# Altium project BauhallenUhr.PrjPcb
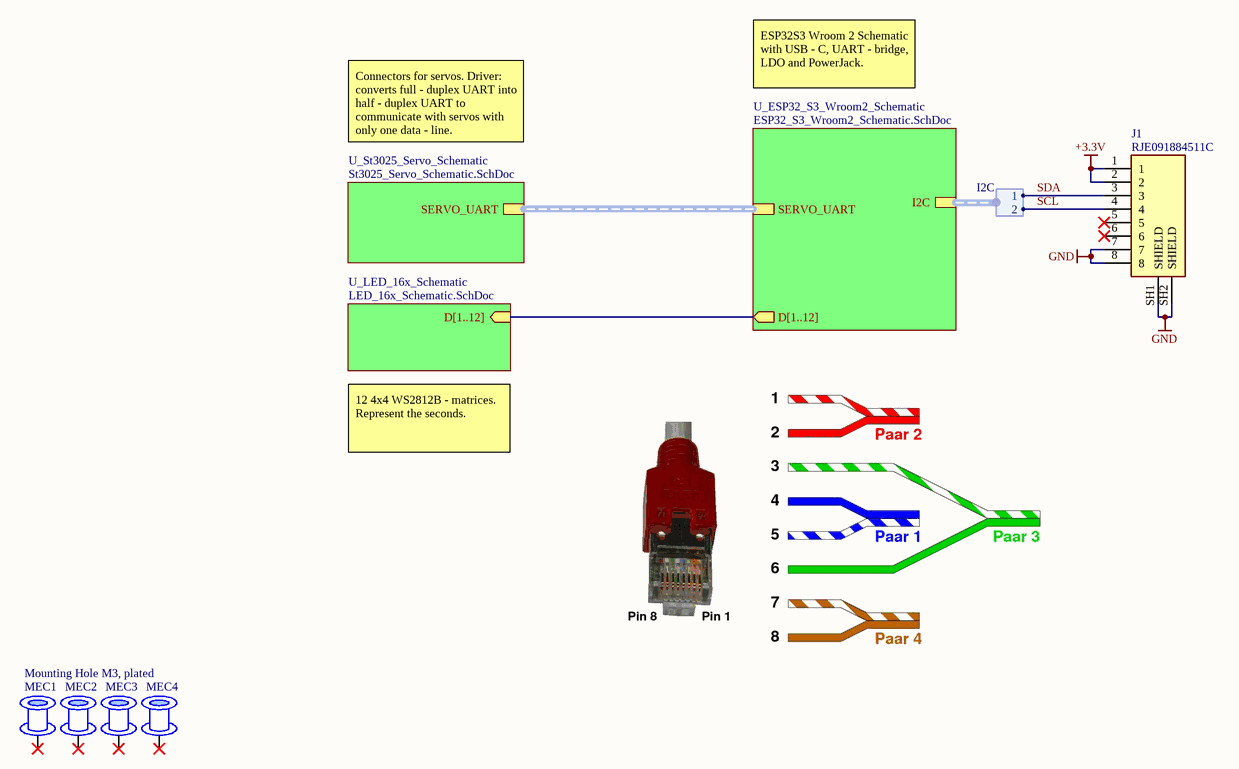
[diagram p0: Blackbox_BauhallenUhr_Schematic.SchDoc]
Author: Manuel Hueppi; Departement: DBAUG; Institut: IBK; Revision: V0.1
4 sheets, 107 parts. Net scope: hierarchical (ports join the sheet entries above them; power ports are global).
Board file: BauhallenUhr.PcbDoc
Sheets:
  Blackbox_BauhallenUhr_Schematic.SchDoc
    U_St3025_Servo_Schematic = St3025_Servo_Schematic.SchDoc
    U_ESP32_S3_Wroom2_Schematic = ESP32_S3_Wroom2_Schematic.SchDoc
    U_LED_16x_Schematic = LED_16x_Schematic.SchDoc

## Sheet Blackbox_BauhallenUhr_Schematic.SchDoc
size A4; DocumentNumber: 1; SheetNumber: 1; SheetTotal: 6

### Parts
J1  RJE091884511C  [RJ45]
MEC1  Mounting Hole M3, plated  [Mounting Hole M3, plated]
MEC2  Mounting Hole M3, plated  [Mounting Hole M3, plated]  (value not drawn)
MEC3  Mounting Hole M3, plated  [Mounting Hole M3, plated]  (value not drawn)
MEC4  Mounting Hole M3, plated  [Mounting Hole M3, plated]  (value not drawn)

### Sub-sheets
U_ESP32_S3_Wroom2_Schematic = ESP32_S3_Wroom2_Schematic.SchDoc: D[1..12] (out), I2C (harness I2C), SERVO_UART (harness SERVO_UART)
U_LED_16x_Schematic = LED_16x_Schematic.SchDoc: D[1..12] (in)
U_St3025_Servo_Schematic = St3025_Servo_Schematic.SchDoc: SERVO_UART (harness SERVO_UART)

### Harnesses
I2C: 1, 2

### Nets
+3.3V: J1.1 J1.2
GND: J1.7 J1.8 J1.SH1(SHIELD) J1.SH2(SHIELD)
SCL: J1.4 ; sheet U_ESP32_S3_Wroom2_Schematic/I2C.2
SDA: J1.3 ; sheet U_ESP32_S3_Wroom2_Schematic/I2C.1

Not connected (* = marked no-connect by the designer): J1 5* 6*; MEC1 1*; MEC2 1*; MEC3 1*; MEC4 1*

### Buses and harness runs
bus sheet U_ESP32_S3_Wroom2_Schematic/D[1..12] = sheet U_LED_16x_Schematic/D[1..12]
harness sheet U_ESP32_S3_Wroom2_Schematic/SERVO_UART = sheet U_St3025_Servo_Schematic/SERVO_UART

### Notes on the sheet
- ESP32S3 Wroom 2 Schematic with USB - C, UART - bridge, LDO and PowerJack.
- Connectors for servos. Driver: converts full - duplex UART into half - duplex UART to communicate with servos with only one data - line.
- 12 4x4 WS2812B - matrices. Represent the seconds.
- Date:
- Title of drawing:
- Time:
- Drawn by:
- Project:
- Revision:
- Institut:
- Departement:
- Page:
- from:
- File:

### Library data of the parts
J1 = RJ45: Jack Modular Connector 8p8c (RJ45, Ethernet) 90Â° Angle (Right) Shielded Cat3.; MF: Amphenol ICC (Commercial Products); SnapEDA_Link: https://www.snapeda.com/parts/RJE091884511C/Amphenol/view-part/?ref=snap; Package: None; System: Connector; MP: RJE091884511C; Check_prices: https://www.snapeda.com/parts/RJE091884511C/Amphenol/view-part/?ref=eda; Parameter 1: *
MEC1-MEC4 = Mounting Hole M3, plated: Mounting Hole for M3 Screw, plated to connect signal

## Sheet St3025_Servo_Schematic.SchDoc
size A4; DocumentNumber: 3; SheetNumber: 3; SheetTotal: 6
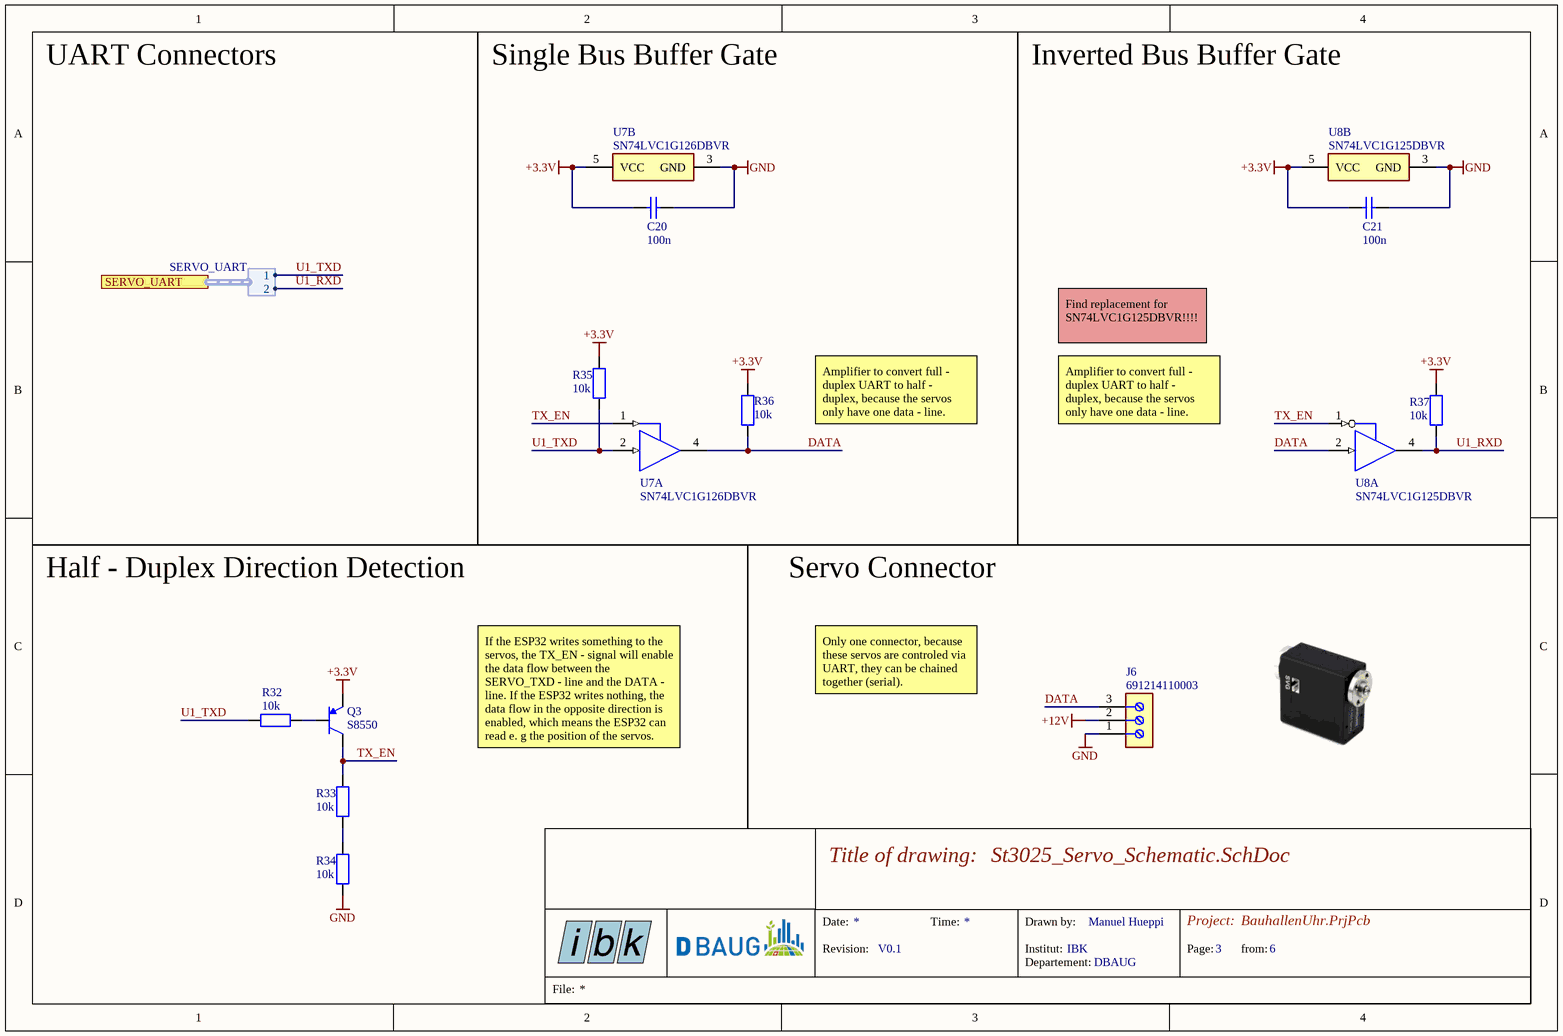
[diagram p1: St3025_Servo_Schematic.SchDoc]

### Parts
C20  100n  [0603_CAPACITOR]
C21  100n  [0603_CAPACITOR]
J6  691214110003  [Screw_Connector]
Q3  S8550  [PNP_Bipolar_Transistor]
R32  10k  [0603_Resistor]
R33  10k  [0603_Resistor]
R34  10k  [0603_Resistor]
R35  10k  [0603_Resistor]
R36  10k  [0603_Resistor]
R37  10k  [0603_Resistor]
U7  SN74LVC1G126DBVR  [DBV0005A_L_Single_Bus_Buffer_Gate]  (parts A,B of 2)
U8  SN74LVC1G125DBVR  [DBV0005A_L_Single_Bus_Buffer_Gate]  (parts A,B of 2)

### Ports
SERVO_UART (harness SERVO_UART)

### Harnesses
SERVO_UART: 1, 2

### Nets
+3.3V: C20.2 C21.2 Q3.2(E) R35.2 R36.2 R37.2 U7.5(VCC) U8.5(VCC)
+12V: J6.2
GND: C20.1 C21.1 J6.1 R34.1 U7.3(GND) U8.3(GND)
DATA: J6.3 R36.1 U7.4(Y) U8.2(A)
TX_EN: Q3.3(C) R33.2 U7.1(OE) U8.1(OE)
U1_RXD: R37.1 U8.4(Y) ; port SERVO_UART.2
U1_TXD: R32.2 R35.1 U7.2(A) ; port SERVO_UART.1
NetQ3_1: Q3.1(B) R32.1
NetR33_1: R33.1 R34.2

### Notes on the sheet
- UART Connectors
- Single Bus Buffer Gate
- Inverted Bus Buffer Gate
- Find replacement for SN74LVC1G125DBVR!!!!
- Amplifier to convert full - duplex UART to half - duplex, because the servos only have one data - line.
- Half - Duplex Direction Detection
- Servo Connector
- Only one connector, because these servos are controled via UART, they can be chained together (serial).
- If the ESP32 writes something to the servos, the TX_EN - signal will enable the data flow between the SERVO_TXD - line and the DATA - line. If the ESP32 writes nothing, the data flow in the opposite direction is enabled, which means the ESP32 can read e. g the position of the servos.
- Date:
- Title of drawing:
- Time:
- Drawn by:
- Project:
- Revision:
- Institut:
- Departement:
- Page:
- from:
- File:

### Library data of the parts
C20 C21 = Capacitor: 0603
J6 = Screw_Connector: 691214110003 Wurth Elektronik
Q3 = PNP_Bipolar_Transistor: Bipolar (BJT) Transistor PNP 25 V 500 mA 150MHz 300 mW Surface Mount SOT-23.
R32-R37 = Resistor: 0603
U7 = Single_Bus_Buffer_Gate: Single Bus Buffer Gate With 3-State Outputs, DBV0005A, LARGE T&R.; ComponentLink1Description: Supplier; ComponentLink1URL: https://www.digikey.com/en/products/detail/texas-instruments/SN74LVC1G126DBVR/385722
U8 = Single_Bus_Buffer_Gate_Inverted: Single Bus Buffer Gate With 3-State Outputs, DBV0005A, LARGE T&R.; ComponentLink1Description: Supplier; ComponentLink1URL: *

## Sheet ESP32_S3_Wroom2_Schematic.SchDoc
size A3; DocumentNumber: 2; SheetNumber: 2; SheetTotal: 6
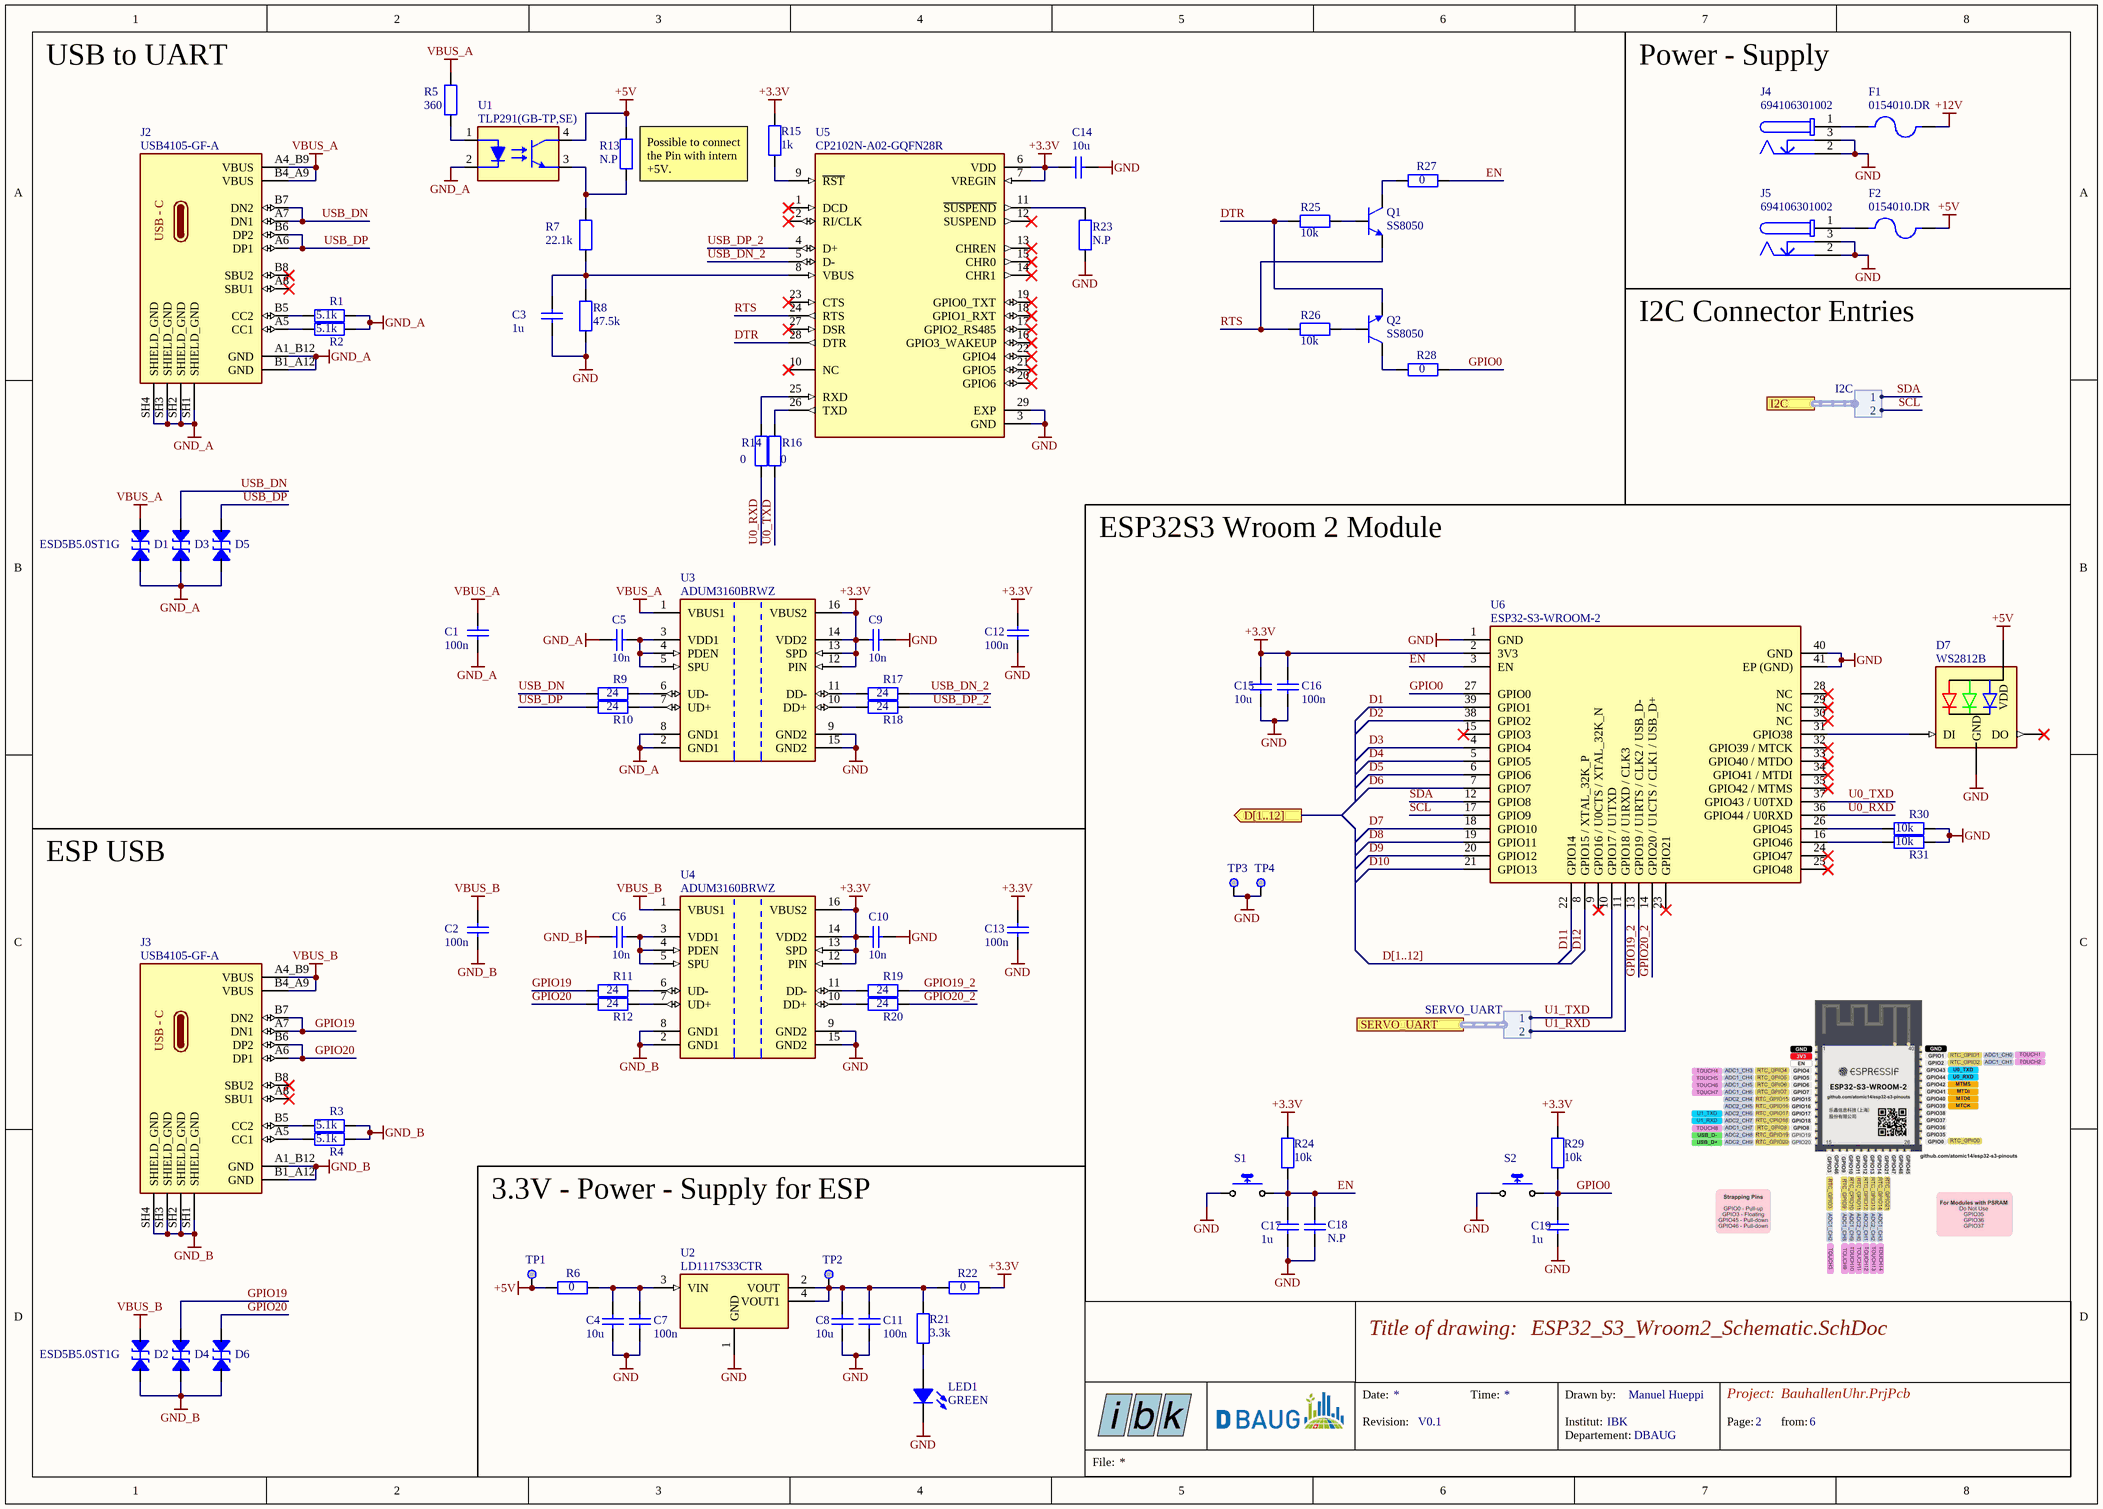
[diagram p2: ESP32_S3_Wroom2_Schematic.SchDoc]

### Parts
C1  100n  [0603_CAPACITOR]
C2  100n  [0603_CAPACITOR]
C3  1u  [0603_CAPACITOR]
C4  10u  [0603_CAPACITOR]
C5  10n  [0603_CAPACITOR]
C6  10n  [0603_CAPACITOR]
C7  100n  [0603_CAPACITOR]
C8  10u  [0603_CAPACITOR]
C9  10n  [0603_CAPACITOR]
C10  10n  [0603_CAPACITOR]
C11  100n  [0603_CAPACITOR]
C12  100n  [0603_CAPACITOR]
C13  100n  [0603_CAPACITOR]
C14  10u  [0603_CAPACITOR]
C15  10u  [0603_CAPACITOR]
C16  100n  [0603_CAPACITOR]
C17  1u  [0603_CAPACITOR]
C18  N.P  [0603_CAPACITOR]
C19  1u  [0603_CAPACITOR]
D1  ESD5B5.0ST1G  [ESD_Protecction_Diode]
D2  ESD5B5.0ST1G  [ESD_Protecction_Diode]
D3  ESD5B5.0ST1G  [ESD_Protecction_Diode]  (value not drawn)
D4  ESD5B5.0ST1G  [ESD_Protecction_Diode]  (value not drawn)
D5  ESD5B5.0ST1G  [ESD_Protecction_Diode]  (value not drawn)
D6  ESD5B5.0ST1G  [ESD_Protecction_Diode]  (value not drawn)
D7  WS2812B  [WS2812B]
F1  0154010.DR  [Fuse]
F2  0154010.DR  [Fuse]
J2  USB4105-GF-A  [USB4105-GF-A]
J3  USB4105-GF-A  [USB4105-GF-A]
J4  694106301002  [DC_PowerJack_THT]
J5  694106301002  [DC_PowerJack_THT]
LED1  GREEN  [LED_0603, GREEN]
Q1  SS8050  [NPN_Bipolar_Transistor]
Q2  SS8050  [NPN_Bipolar_Transistor]
R1  5.1k  [0603_Resistor]
R2  5.1k  [0603_Resistor]
R3  5.1k  [0603_Resistor]
R4  5.1k  [0603_Resistor]
R5  360  [0603_Resistor]
R6  0  [0603_Resistor]
R7  22.1k  [0603_Resistor]
R8  47.5k  [0603_Resistor]
R9  24  [0603_Resistor]
R10  24  [0603_Resistor]
R11  24  [0603_Resistor]
R12  24  [0603_Resistor]
R13  N.P  [0603_Resistor]
R14  0  [0603_Resistor]
R15  1k  [0603_Resistor]
R16  0  [0603_Resistor]
R17  24  [0603_Resistor]
R18  24  [0603_Resistor]
R19  24  [0603_Resistor]
R20  24  [0603_Resistor]
R21  3.3k  [0603_Resistor]
R22  0  [0603_Resistor]
R23  N.P  [0603_Resistor]
R24  10k  [0603_Resistor]
R25  10k  [0603_Resistor]
R26  10k  [0603_Resistor]
R27  0  [0603_Resistor]
R28  0  [0603_Resistor]
R29  10k  [0603_Resistor]
R30  10k  [0603_Resistor]
R31  10k  [0603_Resistor]
S1  ?  [PTS636SK25SMTR]  (value not drawn)
S2  ?  [PTS636SK25SMTR]  (value not drawn)
TP1  Testpoint S2761-46R  [Testpoint S2761-46R]  (value not drawn)
TP2  Testpoint S2761-46R  [Testpoint S2761-46R]  (value not drawn)
TP3  Testpoint S2761-46R  [Testpoint S2761-46R]  (value not drawn)
TP4  Testpoint S2761-46R  [Testpoint S2761-46R]  (value not drawn)
U1  TLP291(GB-TP,SE)  [Optocoupler]
U2  LD1117S33CTR  [LD1117S33CTR]
U3  ADUM3160BRWZ  [USB_Digital_Isolator_A]
U4  ADUM3160BRWZ  [USB_Digital_Isolator_A]
U5  CP2102N-A02-GQFN28R  [CP2102N-A02-GQFN28R]
U6  ESP32-S3-WROOM-2  [ESP32-S3-WROOM-2]

### Ports
D[1..12] (out), I2C (harness I2C), SERVO_UART (harness SERVO_UART)

### Harnesses
SERVO_UART: 1, 2
I2C: 1, 2

### Nets
+3.3V: C9.1 C10.1 C12.2 C13.2 C14.2 C15.2 C16.2 R15.2 R22.2 R24.2 R29.2 U3.12(PIN) U3.13(SPD) U3.14(VDD2) U3.16(VBUS2) U4.12(PIN) U4.13(SPD) U4.14(VDD2) U4.16(VBUS2) U5.6(VDD) U5.7(VREGIN) U6.2(3V3)
+5V: D7.1-VDD(VDD) F2.2 R6.1 R13.2 TP1.1 U1.4(COL)
+12V: F1.2
GND: C3.2 C4.1 C7.1 C8.1 C9.2 C10.2 C11.1 C12.1 C13.1 C14.1 C15.1 C16.1 C17.1 C18.1 C19.1 D7.3-GND(GND) J4.2 J4.3 J5.2 J5.3 LED1.K R8.1 R23.1 R30.2 R31.2 S1.1 S2.1 TP3.1 TP4.1 U2.1(GND) U3.9(GND2) U3.15(GND2) U4.9(GND2) U4.15(GND2) U5.3(GND) U5.29(EXP) U6.1(GND) U6.40(GND) U6.41(EP_(GND))
GND_A: C1.1 C5.2 D1.A(P$1) D3.A(P$1) D5.A(P$1) J2.A1_B12(GND) J2.B1_A12(GND) J2.SH1(SHIELD_GND) J2.SH2(SHIELD_GND) J2.SH3(SHIELD_GND) J2.SH4(SHIELD_GND) R1.2 R2.2 U1.2(C) U3.2(GND1) U3.8(GND1)
GND_B: C2.1 C6.2 D2.A(P$1) D4.A(P$1) D6.A(P$1) J3.A1_B12(GND) J3.B1_A12(GND) J3.SH1(SHIELD_GND) J3.SH2(SHIELD_GND) J3.SH3(SHIELD_GND) J3.SH4(SHIELD_GND) R3.2 R4.2 U4.2(GND1) U4.8(GND1)
VBUS_A: C1.2 D1.K(P$2) J2.A4_B9(VBUS) J2.B4_A9(VBUS) R5.2 U3.1(VBUS1)
VBUS_B: C2.2 D2.K(P$2) J3.A4_B9(VBUS) J3.B4_A9(VBUS) U4.1(VBUS1)
D1: U6.39(GPIO1)
D2: U6.38(GPIO2)
D3: U6.4(GPIO4)
D4: U6.5(GPIO5)
D5: U6.6(GPIO6)
D6: U6.7(GPIO7)
D7: U6.18(GPIO10)
D8: U6.19(GPIO11)
D9: U6.20(GPIO12)
D10: U6.21(GPIO13)
D11: U6.22(GPIO14)
D12: U6.8(GPIO15_/_XTAL_32K_P)
DTR: Q2.2(E) R25.2 U5.28(DTR)
EN: C17.2 C18.2 R24.1 R27.2 S1.2 U6.3(EN)
GPIO0: C19.2 R28.2 R29.1 S2.2 U6.27(GPIO0)
GPIO19: D4.K(P$2) J3.A7(DN1) J3.B7(DN2) R11.1
GPIO19_2: R19.2 U6.13(GPIO19_/_U1RTS_/_CLK2_/_USB_D-)
GPIO20: D6.K(P$2) J3.A6(DP1) J3.B6(DP2) R12.1
GPIO20_2: R20.2 U6.14(GPIO20_/_U1CTS_/_CLK1_/_USB_D+)
RTS: Q1.2(E) R26.2 U5.24(RTS)
SCL: U6.17(GPIO9) ; port I2C.2
SDA: U6.12(GPIO8) ; port I2C.1
U0_RXD: R14.1 U6.36(GPIO44_/_U0RXD)
U0_TXD: R16.1 U6.37(GPIO43_/_U0TXD)
U1_RXD: U6.11(GPIO18_/_U1RXD_/_CLK3) ; port SERVO_UART.2
U1_TXD: U6.10(GPIO17_/_U1TXD) ; port SERVO_UART.1
USB_DN: D3.K(P$2) J2.A7(DN1) J2.B7(DN2) R9.1
USB_DN_2: R17.2 U5.5(D-)
USB_DP: D5.K(P$2) J2.A6(DP1) J2.B6(DP2) R10.1
USB_DP_2: R18.2 U5.4(D+)
NetC3_1: C3.1 R7.1 R8.2 U5.8(VBUS)
NetC4_2: C4.2 C7.2 R6.2 U2.3(VIN)
NetC5_1: C5.1 U3.3(VDD1) U3.4(PDEN) U3.5(SPU)
NetC6_1: C6.1 U4.3(VDD1) U4.4(PDEN) U4.5(SPU)
NetC8_2: C8.2 C11.2 R21.2 R22.1 TP2.1 U2.2(VOUT) U2.4(VOUT1)
NetD7_4-DIN: D7.4-DIN(DI) U6.31(GPIO38)
NetF1_1: F1.1 J4.1
NetF2_1: F2.1 J5.1
NetJ2_A5: J2.A5(CC1) R2.1
NetJ2_B5: J2.B5(CC2) R1.1
NetJ3_A5: J3.A5(CC1) R4.1
NetJ3_B5: J3.B5(CC2) R3.1
NetLED1_A: LED1.A R21.1
NetQ1_1: Q1.1(B) R25.1
NetQ1_3: Q1.3(C) R27.1
NetQ2_1: Q2.1(B) R26.1
NetQ2_3: Q2.3(C) R28.1
NetR5_1: R5.1 U1.1(A)
NetR7_2: R7.2 R13.1 U1.3(EMIT)
NetR9_2: R9.2 U3.6(UD-)
NetR10_2: R10.2 U3.7(UD+)
NetR11_2: R11.2 U4.6(UD-)
NetR12_2: R12.2 U4.7(UD+)
NetR14_2: R14.2 U5.25(RXD)
NetR15_1: R15.1 U5.9(~{RST})
NetR16_2: R16.2 U5.26(TXD)
NetR17_1: R17.1 U3.11(DD-)
NetR18_1: R18.1 U3.10(DD+)
NetR19_1: R19.1 U4.11(DD-)
NetR20_1: R20.1 U4.10(DD+)
NetR23_2: R23.2 U5.11(~{SUSPEND})
NetR30_1: R30.1 U6.26(GPIO45)
NetR31_1: R31.1 U6.16(GPIO46)

Not connected (* = marked no-connect by the designer): D7 2-DOUT(DO)*; J2 A8(SBU1)* B8(SBU2)*; J3 A8(SBU1)* B8(SBU2)*; U5 1(DCD)* 2(RI/CLK)* 10(NC)* 12(SUSPEND)* 13(CHREN)* 14(CHR1)* 15(CHR0)* 16(GPIO3_WAKEUP)* 17(GPIO2_RS485)* 18(GPIO1_RXT)* 19(GPIO0_TXT)* 20(GPIO6)* 21(GPIO5)* 22(GPIO4)* 23(CTS)* 27(DSR)*; U6 9(GPIO16_/_U0CTS_/_XTAL_32K_N)* 15(GPIO3)* 23(GPIO21)* 24(GPIO47)* 25(GPIO48)* 28(NC)* 29(NC)* 30(NC)* 32(GPIO39_/_MTCK)* 33(GPIO40_/_MTDO)* 34(GPIO41_/_MTDI)* 35(GPIO42_/_MTMS)*

### Buses and harness runs
bus D[1..12] = port D[1..12]

### Notes on the sheet
- USB to UART
- Power - Supply
- (near R13) Possible to connect the Pin with intern +5V.
- (near J5) I2C Connector Entries
- ESP32S3 Wroom 2 Module
- ESP USB
- 3.3V - Power - Supply for ESP
- Date:
- Title of drawing:
- Time:
- Drawn by:
- Project:
- Revision:
- Institut:
- Departement:
- Page:
- from:
- File:
- (in symbol USB4105-GF-A) USB - C

### Library data of the parts
C1-C19 = Capacitor: 0603
D1-D6 = ESD_Protection_Diode: ComponentLink1Description: Supplier; ComponentLink1URL: https://www.digikey.com/en/products/detail/onsemi/ESD5B5-0ST1G/1792206
F1 F2 = Fuse: FUSE BRD MNT 10A 125VAC/VDC SMD | Littelfuse 0154010.DR.
J2 J3 = USB4105-GF-A: USB - C - Port
J4 J5 = DC_PowerJack_THT: DCPowerJack_THT_R/A_Plastic_CenterPin_ Ã˜2.0.
LED1 = LED_0603, GREEN: LED 0603, Green, 3.2 V, 20 mA, 430 mcd
Q1 Q2 = NPN_Bipolar_Transistor: SS8050 SOT - 23.; ComponentLink1Description: Supplier; ComponentLink1URL: https://www.digikey.com/en/products/detail/guangdong-inmark-electronics-co-ltd/SS8050/28539054
R1-R31 = Resistor: 0603
S1 S2 = Button
TP1-TP4 = Testpoint S2761-46R: Prüfstecker und Messbuchsen EZ BoardWare S27 SMT Mini Test Terminal, Reel
U1 = Optocoupler: Optoisolator Transistor Output 3750Vrms 1 Channel 4-SO.
U2 = LD1117S33CTR: LDO, 3.3V and 800mA.; ComponentLink1Description: Datasheet; ComponentLink1URL: chrome-extension://efaidnbmnnnibpcajpcglclefindmkaj/https://www.st.com/content/ccc/resource/technical/document/datasheet/99/3b/7d/91/91/51/4b/be/CD00000544.pdf/files/CD00000544.pdf/jcr:content/translations/en.CD00000544.pdf; ComponentLink2Description: Supplier; ComponentLink2URL: https://www.digikey.ch/en/products/detail/stmicroelectronics/LD1117S33CTR/585765
U3 U4 = USB_Digital_Isolator: DGT ISOL 2500VRMS 2CH USB 16SOIC.
U5 = CP2102N-A02-GQFN28R: USB to UART bridge.; ComponentLink1Description: Datasheet; ComponentLink1URL: chrome-extension://efaidnbmnnnibpcajpcglclefindmkaj/https://www.silabs.com/documents/public/data-sheets/cp2102n-datasheet.pdf; ComponentLink2Description: Supplierlink; ComponentLink2URL: https://www.digikey.ch/en/products/detail/silicon-laboratories-inc/CP2102N-A02-GQFN28R/9863486?utm_source=findchips&utm_medium=aggregator&utm_campaign=buynow
U6 = ESP32-S3-WROOM-2-N32R16V: Bluetooth, WiFi 802.11b/g/n, Bluetooth v5.0 Transceiver Module 2.4GHz PCB Trace Surface Mount; Manufacturer: Espressif Systems; Latest Revision Made By: Simon Gimple; Latest Revision Note: New Part; Assembly Technology: SMD; Latest Revision Date: 17.10.2025; Manufacturer Part Number: ESP32-S3-WROOM-2-N32R16V; Note Schematic: *; SMS-Lab Part Number: *; Supplier 1: DigiKey; Supplier 2: Mouser; Supplier 3: *; Supplier 1 Part Number: 1965-ESP32-S3-WROOM-2-N32R16VCT-ND; Supplier 2 Part Number: 356-SP32S3WM2N32R16V; Supplier 3 Part Number: *; Value: *; ComponentLink1Description: Show Datasheet on SMS Drive; ComponentLink1URL: P:\Electronic Workshop\Datasheets (Refered in Libraries - Don't Change!)\ESP32-S3-WROOM-2-N32R16V_Digikey_1965-ESP32-S3-WROOM-2-N32R16VCT-ND.pdf

## Sheet LED_16x_Schematic.SchDoc
size A4; DocumentNumber: 4; SheetNumber: 4; SheetTotal: 6
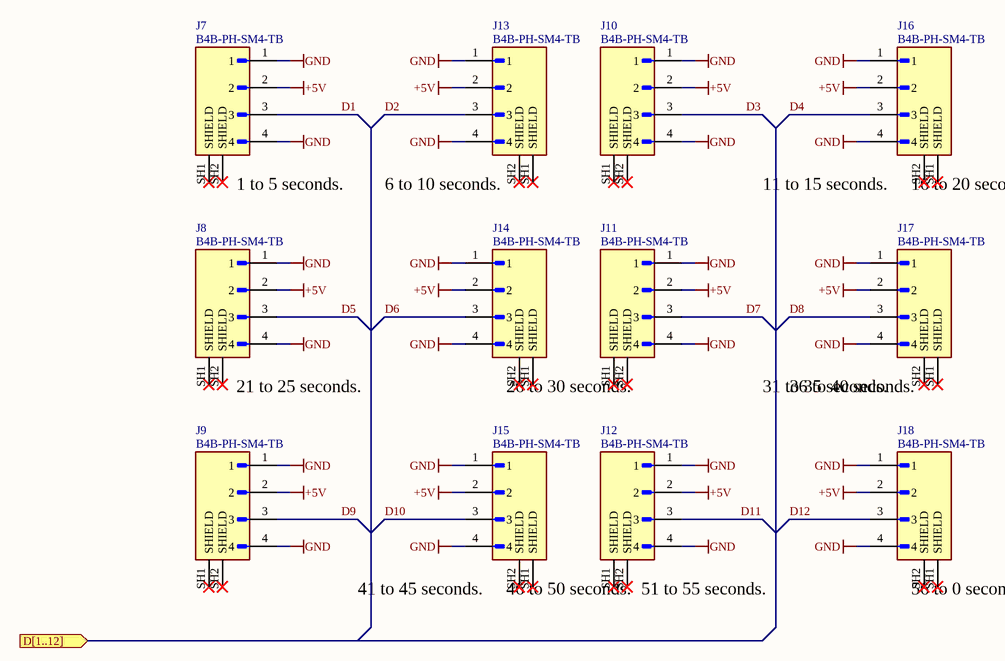
[diagram p3: LED_16x_Schematic.SchDoc]

### Parts
J7  B4B-PH-SM4-TB  [Connector_SMD]
J8  B4B-PH-SM4-TB  [Connector_SMD]
J9  B4B-PH-SM4-TB  [Connector_SMD]
J10  B4B-PH-SM4-TB  [Connector_SMD]
J11  B4B-PH-SM4-TB  [Connector_SMD]
J12  B4B-PH-SM4-TB  [Connector_SMD]
J13  B4B-PH-SM4-TB  [Connector_SMD]
J14  B4B-PH-SM4-TB  [Connector_SMD]
J15  B4B-PH-SM4-TB  [Connector_SMD]
J16  B4B-PH-SM4-TB  [Connector_SMD]
J17  B4B-PH-SM4-TB  [Connector_SMD]
J18  B4B-PH-SM4-TB  [Connector_SMD]

### Ports
D[1..12] (in)

### Nets
+5V: J7.2 J8.2 J9.2 J10.2 J11.2 J12.2 J13.2 J14.2 J15.2 J16.2 J17.2 J18.2
GND: J7.1 J7.4 J8.1 J8.4 J9.1 J9.4 J10.1 J10.4 J11.1 J11.4 J12.1 J12.4 J13.1 J13.4 J14.1 J14.4 J15.1 J15.4 J16.1 J16.4 J17.1 J17.4 J18.1 J18.4
D1: J7.3
D2: J13.3
D3: J10.3
D4: J16.3
D5: J8.3
D6: J14.3
D7: J11.3
D8: J17.3
D9: J9.3
D10: J15.3
D11: J12.3
D12: J18.3

Not connected (* = marked no-connect by the designer): J7 SH1(SHIELD)* SH2(SHIELD)*; J8 SH1(SHIELD)* SH2(SHIELD)*; J9 SH1(SHIELD)* SH2(SHIELD)*; J10 SH1(SHIELD)* SH2(SHIELD)*; J11 SH1(SHIELD)* SH2(SHIELD)*; J12 SH1(SHIELD)* SH2(SHIELD)*; J13 SH1(SHIELD)* SH2(SHIELD)*; J14 SH1(SHIELD)* SH2(SHIELD)*; J15 SH1(SHIELD)* SH2(SHIELD)*; J16 SH1(SHIELD)* SH2(SHIELD)*; J17 SH1(SHIELD)* SH2(SHIELD)*; J18 SH1(SHIELD)* SH2(SHIELD)*

### Notes on the sheet
- (near J7) 1 to 5 seconds.
- (near J13) 6 to 10 seconds.
- (near J10) 11 to 15 seconds.
- (near J16) 16 to 20 seconds.
- (near J8) 21 to 25 seconds.
- (near J14) 26 to 30 seconds.
- (near J11) 31 to 35 seconds.
- (near J17) 36 to 40 seconds.
- (near J9) 41 to 45 seconds.
- (near J15) 46 to 50 seconds.
- (near J12) 51 to 55 seconds.
- (near J18) 56 to 0 seconds.
- Date:
- Title of drawing:
- Time:
- Drawn by:
- Project:
- Revision:
- Institut:
- Departement:
- Page:
- from:
- File:

### Library data of the parts
J7-J18 = Connector_SMD: CONN HEADER SMD 4POS 2MM.; ComponentLink1Description: Supplier; ComponentLink1URL: https://www.digikey.ch/en/products/detail/jst-sales-america-inc/B4B-PH-SM4-TB/926643

## Nets that join several sheets
+3.3V: Blackbox_BauhallenUhr_Schematic (J1.1 J1.2), St3025_Servo_Schematic (8 pins), ESP32_S3_Wroom2_Schematic (22 pins)
+5V: ESP32_S3_Wroom2_Schematic (6 pins), LED_16x_Schematic (12 pins)
+12V: St3025_Servo_Schematic (J6.2), ESP32_S3_Wroom2_Schematic (F1.2)
GND: Blackbox_BauhallenUhr_Schematic (J1.7 J1.8 J1.SH1 J1.SH2), St3025_Servo_Schematic (6 pins), ESP32_S3_Wroom2_Schematic (39 pins), LED_16x_Schematic (24 pins)
SCL: Blackbox_BauhallenUhr_Schematic (J1.4), ESP32_S3_Wroom2_Schematic (U6.17)
SDA: Blackbox_BauhallenUhr_Schematic (J1.3), ESP32_S3_Wroom2_Schematic (U6.12)
U1_RXD: St3025_Servo_Schematic (R37.1 U8.4), ESP32_S3_Wroom2_Schematic (U6.11)
U1_TXD: St3025_Servo_Schematic (R32.2 R35.1 U7.2), ESP32_S3_Wroom2_Schematic (U6.10)

## Assembly variants
Standard-Variant: all parts fitted
All-Components: all parts fitted